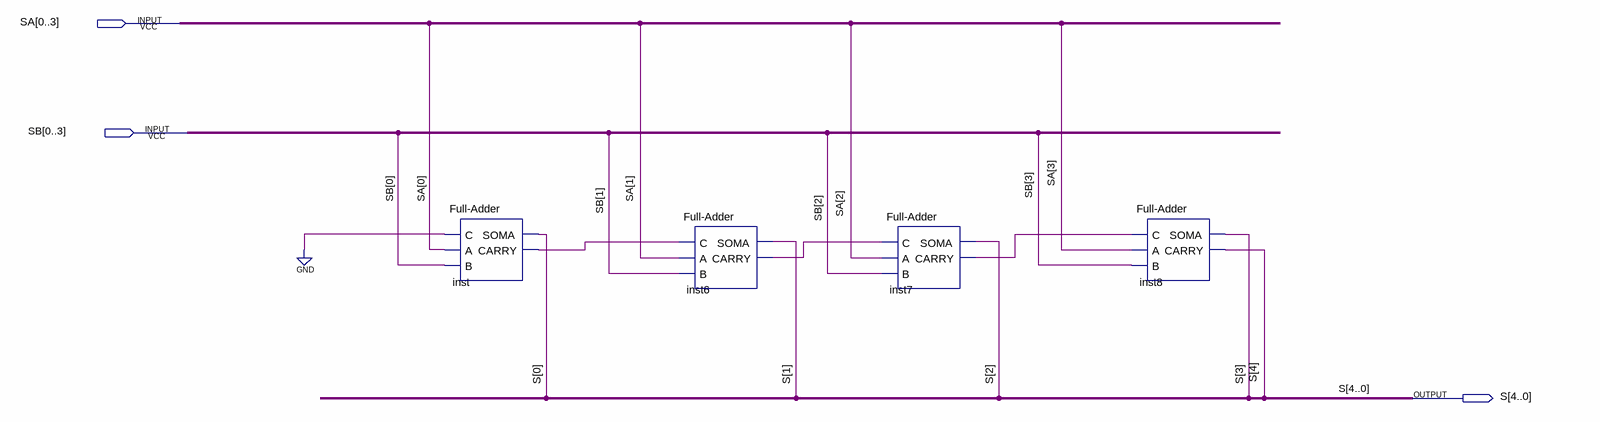
[diagram p0: schematic sheet]
// Quartus schematic SomadorOK.bdf as structural Verilog: 4 symbols, 3 pins
module SomadorOK (
  input  [0:3] SA,
  input  [0:3] SB,
  output [4:0] S
);

  wire inst6_carry, inst7_carry, inst_carry;

  \Full-Adder  inst (.C(1'b0), .A(SA[0]), .B(SB[0]), .SOMA(S[0]), .CARRY(inst_carry));
  \Full-Adder  inst6 (.C(inst_carry), .A(SA[1]), .B(SB[1]), .SOMA(S[1]), .CARRY(inst6_carry));
  \Full-Adder  inst7 (.C(inst6_carry), .A(SA[2]), .B(SB[2]), .SOMA(S[2]), .CARRY(inst7_carry));
  \Full-Adder  inst8 (.C(inst7_carry), .A(SA[3]), .B(SB[3]), .SOMA(S[3]), .CARRY(S[4]));
endmodule
